# Altium project Avionics_Board.PrjPcb
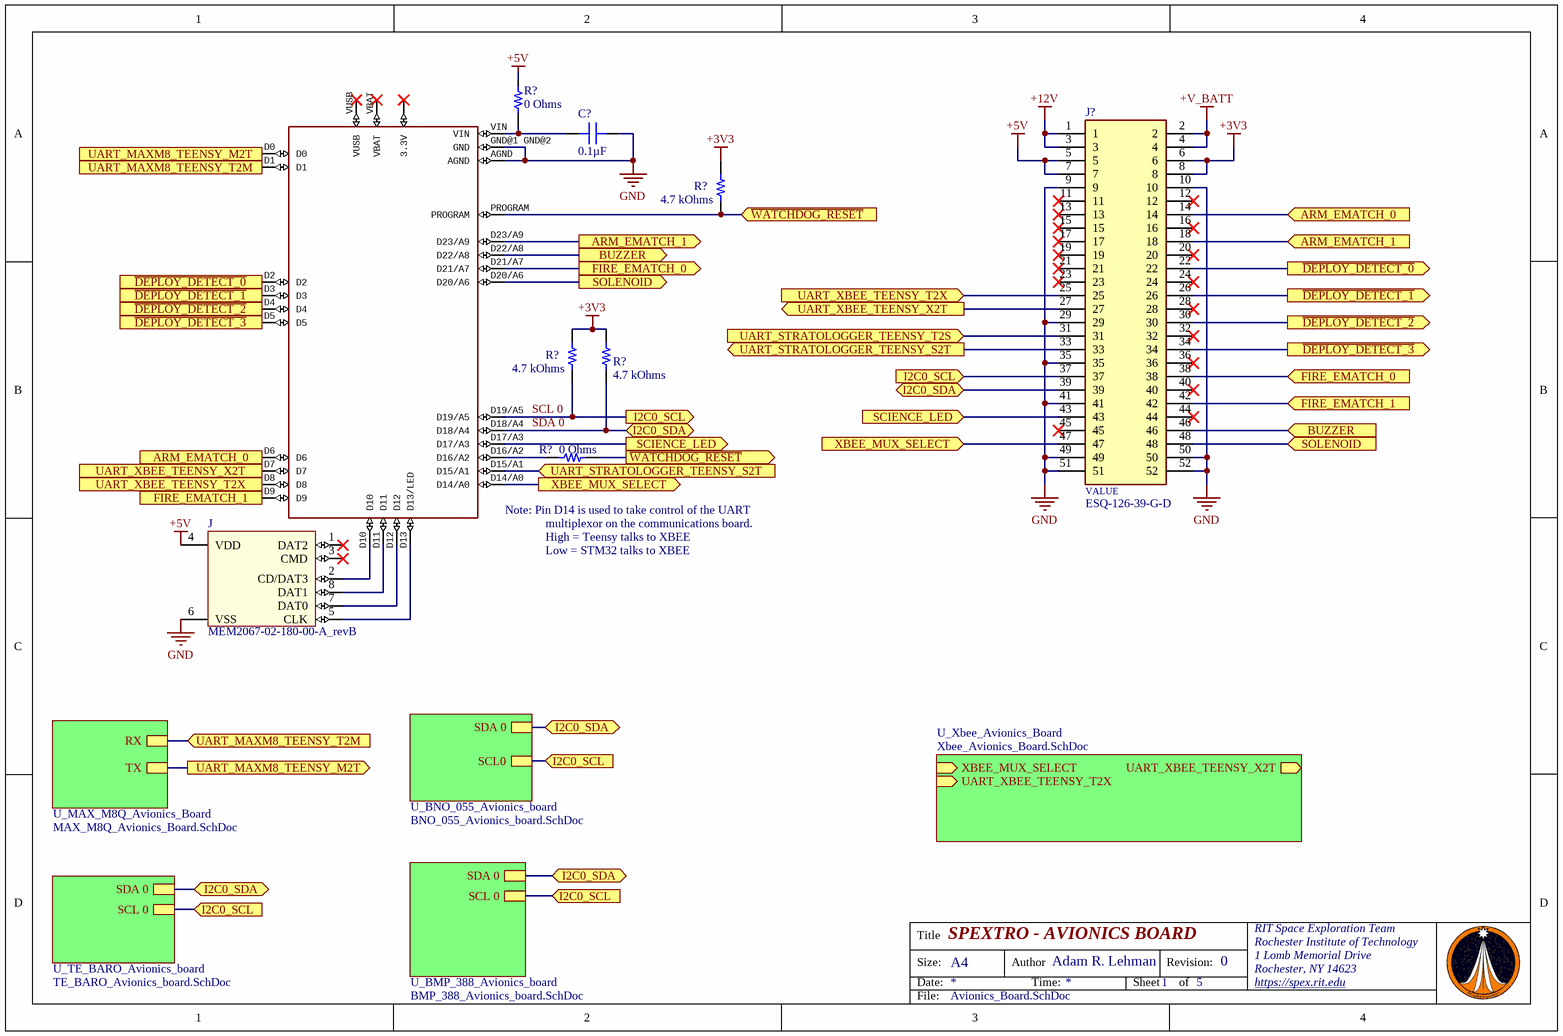
[diagram p0: Avionics_Board.SchDoc]
5 sheets, 39 parts. Net scope: hierarchical (ports join the sheet entries above them; power ports are global).
Sheets:
  Avionics_Board.SchDoc
    U_BMP_388_Avionics_board = BMP_388_Avionics_board.SchDoc
    U_BNO_055_Avionics_board = BNO_055_Avionics_board.SchDoc
    U_MAX_M8Q_Avionics_Board = MAX_M8Q_Avionics_Board.SchDoc
    U_TE_BARO_Avionics_board = TE_BARO_Avionics_board.SchDoc

## Sheet Avionics_Board.SchDoc: SPEXTRO - AVIONICS BOARD
size A4; Author: Adam R. Lehman; Revision: 0; SheetNumber: 1; SheetTotal: 5

### Parts
(Parts that share a designator on the sheet are numbered #1, #2 ... from top to bottom, then left to right.)
?  TEENSY4.0  [TEENSY4.0]  (value not drawn)
C?#1  0.1µF  [CAP 0603_1608]
J  MEM2067-02-180-00-A_revB  [MEM2067-02-180-00-A_revB]
J?#1  ESQ-126-39-G-D  [SAMTEC_ESQ-126-39-G-D]
R?#1  0 Ohms  [RES 0603_1608]
R?#2  4.7 kOhms  [RES 0603_1608]
R?#3  4.7 kOhms  [RES 0603_1608]
R?#4  4.7 kOhms  [RES 0603_1608]
R?#5  0 Ohms  [RES 0603_1608]

### Sub-sheets
U_BMP_388_Avionics_board = BMP_388_Avionics_board.SchDoc: SDA 0, SCL 0
U_BNO_055_Avionics_board = BNO_055_Avionics_board.SchDoc: SDA 0, SCL0
U_MAX_M8Q_Avionics_Board = MAX_M8Q_Avionics_Board.SchDoc: RX, TX
U_TE_BARO_Avionics_board = TE_BARO_Avionics_board.SchDoc: SDA 0, SCL 0
U_Xbee_Avionics_Board = Xbee_Avionics_Board.SchDoc (file not in this document): XBEE_MUX_SELECT (in), UART_XBEE_TEENSY_X2T (out), UART_XBEE_TEENSY_T2X (in)

### Ports
ARM_EMATCH_0 (in), ARM_EMATCH_0 (out), ARM_EMATCH_1 (in), ARM_EMATCH_1 (out), BUZZER (in), BUZZER (out), FIRE_EMATCH_0 (in), FIRE_EMATCH_0 (out), FIRE_EMATCH_1 (in), FIRE_EMATCH_1 (out), I2C0_SCL (in), I2C0_SCL (out), I2C0_SDA (bidir), SCIENCE_LED (in), SCIENCE_LED (out), SOLENOID (in), SOLENOID (out), UART_MAXM8_TEENSY_M2T (in), UART_MAXM8_TEENSY_M2T (out), UART_MAXM8_TEENSY_T2M (in), UART_MAXM8_TEENSY_T2M (out), UART_STRATOLOGGER_TEENSY_S2T (in), UART_STRATOLOGGER_TEENSY_S2T (out), UART_STRATOLOGGER_TEENSY_T2S (in), UART_XBEE_TEENSY_T2X (in), UART_XBEE_TEENSY_T2X (out), UART_XBEE_TEENSY_X2T (in), UART_XBEE_TEENSY_X2T (out), XBEE_MUX_SELECT (in), XBEE_MUX_SELECT (out), ~{DEPLOY_DETECT_0} (in), ~{DEPLOY_DETECT_0} (out), ~{DEPLOY_DETECT_1} (in), ~{DEPLOY_DETECT_1} (out), ~{DEPLOY_DETECT_2} (in), ~{DEPLOY_DETECT_2} (out), ~{DEPLOY_DETECT_3} (in), ~{DEPLOY_DETECT_3} (out), ~{WATCHDOG_RESET} (in), ~{WATCHDOG_RESET} (out)

### Nets
+3V3: J?#1.6 J?#1.8 R?#2.1 R?#3.1 R?#4.1
+5V: J.4(VDD) J?#1.5 J?#1.7 R?#1.2
+12V: J?#1.1 J?#1.3
+V_BATT: J?#1.2 J?#1.4
GND: ?.AGND ?.GND@1_GND@2(GND) C?#1.1 J.6(VSS) J?#1.9 J?#1.10 J?#1.29 J?#1.35 J?#1.41 J?#1.49 J?#1.50 J?#1.51 J?#1.52
SCL 0: ?.D19/A5 J?#1.37 R?#3.2 ; port I2C0_SCL, sheet U_BMP_388_Avionics_board/SCL 0, sheet U_BNO_055_Avionics_board/SCL0, sheet U_TE_BARO_Avionics_board/SCL 0
SDA 0: ?.D18/A4 J?#1.39 R?#4.2 ; port I2C0_SDA, sheet U_BMP_388_Avionics_board/SDA 0, sheet U_BNO_055_Avionics_board/SDA 0, sheet U_TE_BARO_Avionics_board/SDA 0
Net?_D0: ?.D0 ; port UART_MAXM8_TEENSY_M2T, sheet U_MAX_M8Q_Avionics_Board/TX
Net?_D1: ?.D1 ; port UART_MAXM8_TEENSY_T2M, sheet U_MAX_M8Q_Avionics_Board/RX
Net?_D2: ?.D2 J?#1.22 ; port ~{DEPLOY_DETECT_0}
Net?_D3: ?.D3 J?#1.26 ; port ~{DEPLOY_DETECT_1}
Net?_D4: ?.D4 J?#1.30 ; port ~{DEPLOY_DETECT_2}
Net?_D5: ?.D5 J?#1.34 ; port ~{DEPLOY_DETECT_3}
Net?_D6: ?.D6 J?#1.14 ; port ARM_EMATCH_0
Net?_D7: ?.D7 J?#1.27 ; port UART_XBEE_TEENSY_X2T
Net?_D8: ?.D8 J?#1.25 ; port UART_XBEE_TEENSY_T2X
Net?_D9: ?.D9 J?#1.42 ; port FIRE_EMATCH_1
Net?_D10: ?.D10 J.2(CD/DAT3)
Net?_D11: ?.D11 J.8(DAT1)
Net?_D12: ?.D12 J.7(DAT0)
Net?_D13: ?.D13(D13/LED) J.5(CLK)
Net?_D14/A0: ?.D14/A0 J?#1.47 ; port XBEE_MUX_SELECT
Net?_D15/A1: ?.D15/A1 J?#1.33 ; port UART_STRATOLOGGER_TEENSY_S2T
Net?_D16/A2: ?.D16/A2 R?#5.2
Net?_D17/A3: ?.D17/A3 J?#1.43 ; port SCIENCE_LED
Net?_D20/A6: ?.D20/A6 J?#1.48 ; port SOLENOID
Net?_D21/A7: ?.D21/A7 J?#1.38 ; port FIRE_EMATCH_0
Net?_D22/A8: ?.D22/A8 J?#1.46 ; port BUZZER
Net?_D23/A9: ?.D23/A9 J?#1.18 ; port ARM_EMATCH_1
Net?_PROGRAM: ?.PROGRAM R?#2.2 R?#5.1 ; port ~{WATCHDOG_RESET}
Net?_VIN: ?.VIN C?#1.2 R?#1.1
NetJ?#1_31: J?#1.31 ; port UART_STRATOLOGGER_TEENSY_T2S

Not connected (* = marked no-connect by the designer): ? ?1(3.3V)* VBAT* VUSB*; J 1(DAT2)* 3(CMD)*; J?#1 11* 12* 13* 15* 16* 17* 19* 20* 21* 23* 24* 28* 32* 36* 40* 44* 45*

### Notes on the sheet
- (near ?) Note: Pin D14 is used to take control of the UART
- multiplexor on the communications board.
- High = Teensy talks to XBEE
- Low = STM32 talks to XBEE
- Title
- Size:
- Date:
- A4
- Author
- Time:
- Sheet
- Revision:
- of
- RIT Space Exploration Team
- Rochester Institute of Technology
- 1 Lomb Memorial Drive
- Rochester, NY 14623
- https://spex.rit.edu
- File:
- (in symbol ESQ-126-39-G-D) VALUE

### Library data of the parts
? = TEENSY4.0: GateName_1: G$1; SymbolName_1: TEENSY4.0; LibraryName: Teensy4.0; DeviceSetName: TEENSY4.0; Package: TEENSY4.0
C?#1 = 100X14W104MV4T: CAP CER 0.1UF 10V X7R 0603; Manufacturer: Johanson Dielectrics Inc.; Tolerance: ±20%; Part Number: 100X14W104MV4T; Value: 0.1µF; Applications: Bypass, Decoupling; Capacitance: 0.1µF; ComponentLink1Description: Datasheet; ComponentLink1URL: https://www.johansondielectrics.com/downloads/x2y-filter-and-decoupling-capacitors.pdf; ComponentLink2Description: DigiKey Link; ComponentLink2URL: http://digikey.com/product-detail/en/johanson-dielectrics-inc/100X14W104MV4T/709-1101-1-ND/1655915; Device Package: 0603 (1608 Metric); Features: Low ESL (X2Y); LastUpdated: 1/21/2020 12:02:09 AM; Lifecycle Status: Active; Minimum Order: 1; Mounting Type: Surface Mount, MLCC; Operating Temperature: -55°C ~ 125°C; Package / Case: 0603 (1608 Metric); Packaging: TapeAndReel; PartId: 2680; Part Status: Active; Price: 0.11; Series: X2Y®; Size / Dimension: 0.064" L x 0.035" W (1.63mm x 0.89mm); Supplier 1: DigiKey; Supplier Part Number 1: 709-1101-1-ND; Temperature Coefficient: X7R; Thickness (Max): 0.026" (0.66mm); Voltage - Rated: 10V
J = MEM2067-02-180-00-A_revB: Micro SD Memory Card ConnectorSMT, Hinged, 1.80mm Profile
J?#1 = ESQ-126-39-G-D: 52 Position Elevated Socket Connector Through Hole; MF: Samtec; Value: *; Digi-Key_Purchase_URL: https://www.digikey.com/product-detail/en/samtec-inc/ESQ-126-39-G-D/SAM10462-ND/3601055?utm_source=snapeda&utm_medium=aggregator&utm_campaign=symbol; Package: None; MP: ESQ-126-39-G-D; SnapEDA_Link: https://www.snapeda.com/parts/ESQ-126-39-G-D/Samtec%20Inc./view-part/490181/?ref=snap; Digi-Key_Part_Number: SAM10462-ND
R?#1 R?#5 = PA0603-R-070RL: METAL CURRENT SENSOR-LOW T.C.R C; Manufacturer: Yageo; Power (Watts): 0.1W, 1/10W; Temperature Coefficient: ±150ppm/°C; Tolerance: Jumper; Part Number: PA0603-R-070RL; Value: 0 Ohms; ComponentLink1Description: Datasheet; ComponentLink1URL: http://www.yageo.com/NewPortal/_en/search/productDocs.jsp?YageoPartNumber=PA0603-R-070RL; ComponentLink2Description: DigiKey Link; ComponentLink2URL: http://digikey.com/product-detail/en/yageo/PA0603-R-070RL/YAG5757CT-ND/8256002; Composition: Metal Element; Device Package: 0603 (1608 Metric); Features: Current Sense, Moisture Resistant; Height - Seated (Max): 0.024" (0.60mm); LastUpdated: 1/21/2020 12:24:55 AM; Lifecycle Status: Active; Minimum Order: 1; Number of Terminations: 2; Operating Temperature: -55°C ~ 155°C; Package / Case: 0603 (1608 Metric); Packaging: TapeAndReel; PartId: 4862; Part Status: Active; Price: 0.09; Resistance: 0 Ohms; Series: PA; Size / Dimension: 0.063" L x 0.031" W (1.60mm x 0.80mm); Supplier 1: DigiKey; Supplier Part Number 1: YAG5757CT-ND; Supplier Device Package: 0603
R?#2-R?#4 = ERA-3AEB472V: RES SMD 4.7K OHM 0.1% 1/10W 0603; Manufacturer: Panasonic Electronic Components; Power (Watts): 0.1W, 1/10W; Temperature Coefficient: ±25ppm/°C; Part Number: ERA-3AEB472V; Value: 4.7 kOhms; ComponentLink1Description: Datasheet; ComponentLink1URL: https://industrial.panasonic.com/cdbs/www-data/pdf/RDM0000/AOA0000C307.pdf; ComponentLink2Description: DigiKey Link; ComponentLink2URL: http://digikey.com/product-detail/en/panasonic-electronic-components/ERA-3AEB472V/P4.7KDBCT-ND/1466068; Composition: Thin Film; Device Package: 0603 (1608 Metric); Features: Automotive AEC-Q200; Height - Seated (Max): 0.022" (0.55mm); LastUpdated: 1/21/2020 12:24:44 AM; Lifecycle Status: Active; Minimum Order: 1; Number of Terminations: 2; Operating Temperature: -55°C ~ 155°C; Package / Case: 0603 (1608 Metric); Packaging: TapeAndReel; PartId: 5519; Part Status: Active; Price: 0.04; Ratings: AEC-Q200; Resistance: 4.7 kOhms; Series: ERA-3A; Size / Dimension: 0.063" L x 0.031" W (1.60mm x 0.80mm); Supplier 1: DigiKey; Supplier Part Number 1: P4.7KDBCT-ND; Supplier Device Package: 0603; Tolerance: ±0.1%

## Sheet BMP_388_Avionics_board.SchDoc: BMP 388 Avionics Board
size A4; Author: Adam R. Lehman; SheetNumber: 3; SheetTotal: 5
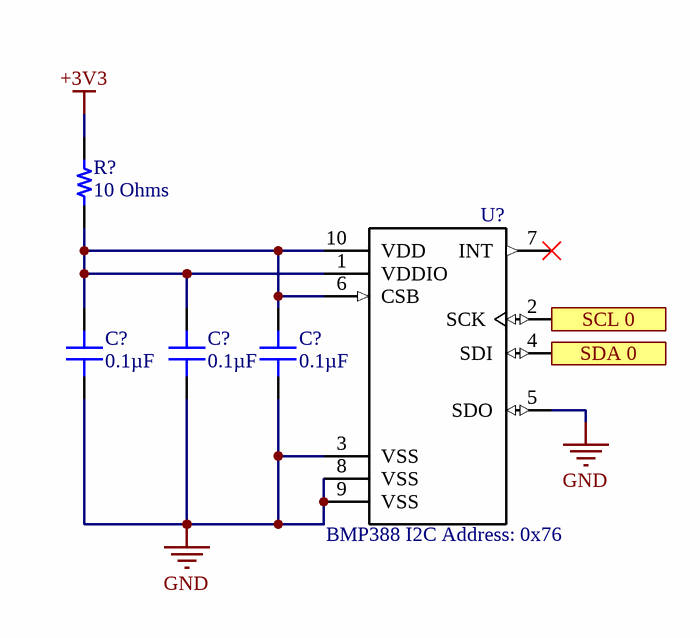
[diagram p1: BMP_388_Avionics_board.SchDoc]

### Parts
(Parts that share a designator on the sheet are numbered #1, #2 ... from top to bottom, then left to right.)
C?#2  0.1µF  [CAP 0603_1608]
C?#3  0.1µF  [CAP 0603_1608]
C?#4  0.1µF  [CAP 0603_1608]
R?#6  10 Ohms  [RES 0603_1608]
U?#1  BMP388 I2C Address: 0x76  [*PQFN50P200X200X80-10N]

### Ports
SCL 0, SDA 0

### Nets
+3V3: R?#6.2
GND: C?#2.1 C?#3.1 C?#4.1 U?#1.3(VSS) U?#1.5(SDO) U?#1.8(VSS) U?#1.9(VSS)
SCL 0: U?#1.2(SCK) ; port SCL 0
SDA 0: U?#1.4(SDI) ; port SDA 0
NetC?#2_2: C?#2.2 C?#3.2 C?#4.2 R?#6.1 U?#1.1(VDDIO) U?#1.6(CSB) U?#1.10(VDD)

Not connected (* = marked no-connect by the designer): U?#1 7(INT)*

### Notes on the sheet
- Title
- Size:
- Date:
- A4
- Author
- Time:
- Sheet
- Revision:
- of
- RIT Space Exploration Team
- Rochester Institute of Technology
- 1 Lomb Memorial Drive
- Rochester, NY 14623
- https://spex.rit.edu
- File:

### Library data of the parts
C?#2-C?#4 = 100X14W104MV4T: as C?#1 on sheet Avionics_Board; Part Number: 100X14W104MV4T; Value: 0.1µF; Applications: Bypass, Decoupling; Capacitance: 0.1µF; ComponentLink1Description: Datasheet; ComponentLink1URL: https://www.johansondielectrics.com/downloads/x2y-filter-and-decoupling-capacitors.pdf; ComponentLink2Description: DigiKey Link; ComponentLink2URL: http://digikey.com/product-detail/en/johanson-dielectrics-inc/100X14W104MV4T/709-1101-1-ND/1655915; Device Package: 0603 (1608 Metric); Features: Low ESL (X2Y); LastUpdated: 1/21/2020 12:02:09 AM; Lifecycle Status: Active; Minimum Order: 1; Mounting Type: Surface Mount, MLCC; Operating Temperature: -55°C ~ 125°C; Package / Case: 0603 (1608 Metric); Packaging: TapeAndReel; PartId: 2680; Part Status: Active; Price: 0.11; Series: X2Y®; Size / Dimension: 0.064" L x 0.035" W (1.63mm x 0.89mm); Supplier 1: DigiKey; Supplier Part Number 1: 709-1101-1-ND; Temperature Coefficient: X7R; Thickness (Max): 0.026" (0.66mm); Voltage - Rated: 10V
R?#6 = SG731JTTD100K: SMD RESISTOR; Manufacturer: KOA Speer Electronics, Inc.; Power (Watts): 0.1W, 1/10W; Temperature Coefficient: ±200ppm/°C; Tolerance: ±10%; Part Number: SG731JTTD100K; Value: 10 Ohms; ComponentLink1Description: Datasheet; ComponentLink1URL: http://www.koaspeer.com/catimages/Products/SG73/SG73.pdf; ComponentLink2Description: DigiKey Link; ComponentLink2URL: http://digikey.com/product-detail/en/koa-speer-electronics-inc/SG731JTTD100K/2019-SG731JTTD100KCT-ND/10187255; Composition: Thick Film; Device Package: 0603 (1608 Metric); Features: Automotive AEC-Q200, Moisture Resistant, Pulse Withstanding; Height - Seated (Max): 0.022" (0.55mm); LastUpdated: 1/21/2020 12:19:43 AM; Lifecycle Status: Active; Minimum Order: 1; Number of Terminations: 2; Operating Temperature: -55°C ~ 155°C; Package / Case: 0603 (1608 Metric); Packaging: TapeAndReel; PartId: 17783; Part Status: Active; Price: 0.02; Ratings: AEC-Q200; Resistance: 10 Ohms; Series: SG73; Size / Dimension: 0.063" L x 0.031" W (1.60mm x 0.80mm); Supplier 1: DigiKey; Supplier Part Number 1: 2019-SG731JTTD100KCT-ND; Supplier Device Package: 0603
U?#1 = BMP388: Pressure Sensor 4.35PSI ~ 18.13PSI _30kPa ~ 125kPa_ Absolute 10-WFLGA; MF: Bosch Sensortec; Digi-Key_Part_Number: 828-1079-1-ND; SnapEDA_Link: https://www.snapeda.com/parts/BMP388/Bosch%20Sensortec/view-part/2747857/?ref=snap; Package: WFLGA-10 Bosch Tools; Digi-Key_Purchase_URL: https://www.digikey.com/product-detail/en/bosch-sensortec/BMP388/828-1079-1-ND/8322640?utm_source=snapeda&utm_medium=aggregator&utm_campaign=symbol; MP: BMP388; Value: *

## Sheet BNO_055_Avionics_board.SchDoc: BNO 055 - Avionics Board
size A4; Author: Adam R. Lehman; SheetNumber: 2; SheetTotal: 5
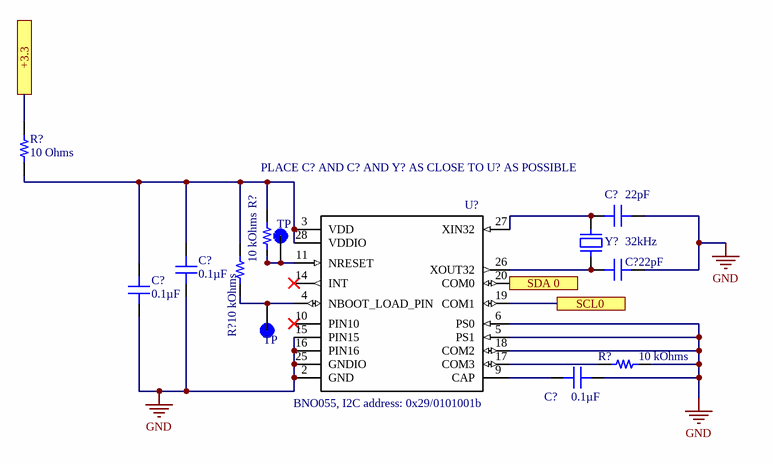
[diagram p2: BNO_055_Avionics_board.SchDoc]

### Parts
(Parts that share a designator on the sheet are numbered #1, #2 ... from top to bottom, then left to right.)
C?#5  22pF  [CAP 0603_1608]
C?#6  0.1µF  [CAP 0603_1608]
C?#7  22pF  [CAP 0603_1608]
C?#8  0.1µF  [CAP 0603_1608]
C?#9  0.1µF  [CAP 0603_1608]
R?#7  10 Ohms  [RES 0603_1608]
R?#8  10 kOhms  [RES 0603_1608]
R?#9  10 kOhms  [RES 0603_1608]
R?#10  10 kOhms  [RES 0603_1608]
TP#1  (no value)  [HARWIN_S2751-46R]
TP#2  (no value)  [HARWIN_S2751-46R]
U?#2  BNO055, I2C address: 0x29/0101001b  [*LGA28R50P4X10_380X520X100]
Y?  32kHz  [ABRACON ABS25]

### Ports
+3.3, SCL0, SDA 0

### Nets
GND: C?#5.2 C?#6.1 C?#7.1 C?#8.1 C?#9.1 R?#10.1 U?#2.2(GND) U?#2.5(PS1) U?#2.6(PS0) U?#2.15(PIN15) U?#2.16(PIN16) U?#2.18(COM2) U?#2.25(GNDIO)
SCL 0: U?#2.19(COM1) ; port SCL0
SDA 0: U?#2.20(COM0) ; port SDA 0
NetC?#5_1: C?#5.1 U?#2.27(XIN32) Y?.1
NetC?#6_2: C?#6.2 C?#8.2 R?#7.1 R?#8.1 R?#9.1 U?#2.3(VDD) U?#2.28(VDDIO)
NetC?#7_2: C?#7.2 U?#2.26(XOUT32) Y?.4
NetC?#9_2: C?#9.2 U?#2.9(CAP)
NetR?#7_2: R?#7.2 ; port +3.3
NetR?#8_2: R?#8.2 TP#1.1(TP) U?#2.11(NRESET)
NetR?#9_2: R?#9.2 TP#2.1(TP) U?#2.4(NBOOT_LOAD_PIN)
NetR?#10_2: R?#10.2 U?#2.17(COM3)

Not connected (* = marked no-connect by the designer): U?#2 10(PIN10)* 14(INT)*

### Notes on the sheet
- PLACE C? AND C? AND Y? AS CLOSE TO U? AS POSSIBLE
- Title
- Size:
- Date:
- A4
- Author
- Time:
- Sheet
- Revision:
- of
- RIT Space Exploration Team
- Rochester Institute of Technology
- 1 Lomb Memorial Drive
- Rochester, NY 14623
- https://spex.rit.edu
- File:

### Library data of the parts
C?#5 C?#7 = C0603C220J5GACTU: CAP CER 22PF 50V C0G/NP0 0603; Manufacturer: KEMET; Temperature Coefficient: C0G, NP0; Tolerance: ±5%; Part Number: C0603C220J5GACTU; Value: 22pF; Applications: General Purpose; Capacitance: 22pF; ComponentLink1Description: Datasheet; ComponentLink1URL: https://api.kemet.com/component-edge/download/datasheet/C0603C220J5GACTU.pdf; ComponentLink2Description: DigiKey Link; ComponentLink2URL: http://digikey.com/product-detail/en/kemet/C0603C220J5GACTU/399-1053-1-ND/411328; Device Package: 0603 (1608 Metric); Features: Low ESL; LastUpdated: 1/21/2020 12:02:09 AM; Lifecycle Status: Active; Minimum Order: 1; Mounting Type: Surface Mount, MLCC; Operating Temperature: -55°C ~ 125°C; Package / Case: 0603 (1608 Metric); Packaging: TapeAndReel; PartId: 2302; Part Status: Active; Price: 0.02; Series: SMD Comm C0G; Size / Dimension: 0.063" L x 0.031" W (1.60mm x 0.80mm); Supplier 1: DigiKey; Supplier Part Number 1: 399-1053-1-ND; Thickness (Max): 0.034" (0.87mm); Voltage - Rated: 50V
C?#6 C?#8 C?#9 = 100X14W104MV4T: as C?#1 on sheet Avionics_Board; Part Number: 100X14W104MV4T; Value: 0.1µF; Applications: Bypass, Decoupling; Capacitance: 0.1µF; ComponentLink1Description: Datasheet; ComponentLink1URL: https://www.johansondielectrics.com/downloads/x2y-filter-and-decoupling-capacitors.pdf; ComponentLink2Description: DigiKey Link; ComponentLink2URL: http://digikey.com/product-detail/en/johanson-dielectrics-inc/100X14W104MV4T/709-1101-1-ND/1655915; Device Package: 0603 (1608 Metric); Features: Low ESL (X2Y); LastUpdated: 1/21/2020 12:02:09 AM; Lifecycle Status: Active; Minimum Order: 1; Mounting Type: Surface Mount, MLCC; Operating Temperature: -55°C ~ 125°C; Package / Case: 0603 (1608 Metric); Packaging: TapeAndReel; PartId: 2680; Part Status: Active; Price: 0.11; Series: X2Y®; Size / Dimension: 0.064" L x 0.035" W (1.63mm x 0.89mm); Supplier 1: DigiKey; Supplier Part Number 1: 709-1101-1-ND; Temperature Coefficient: X7R; Thickness (Max): 0.026" (0.66mm); Voltage - Rated: 10V
R?#7 = SG731JTTD100K: as R?#6 on sheet BMP_388_Avionics_board; Part Number: SG731JTTD100K; Value: 10 Ohms; ComponentLink1Description: Datasheet; ComponentLink1URL: http://www.koaspeer.com/catimages/Products/SG73/SG73.pdf; ComponentLink2Description: DigiKey Link; ComponentLink2URL: http://digikey.com/product-detail/en/koa-speer-electronics-inc/SG731JTTD100K/2019-SG731JTTD100KCT-ND/10187255; Composition: Thick Film; Device Package: 0603 (1608 Metric); Features: Automotive AEC-Q200, Moisture Resistant, Pulse Withstanding; Height - Seated (Max): 0.022" (0.55mm); LastUpdated: 1/21/2020 12:19:43 AM; Lifecycle Status: Active; Minimum Order: 1; Number of Terminations: 2; Operating Temperature: -55°C ~ 155°C; Package / Case: 0603 (1608 Metric); Packaging: TapeAndReel; PartId: 17783; Part Status: Active; Price: 0.02; Ratings: AEC-Q200; Resistance: 10 Ohms; Series: SG73; Size / Dimension: 0.063" L x 0.031" W (1.60mm x 0.80mm); Supplier 1: DigiKey; Supplier Part Number 1: 2019-SG731JTTD100KCT-ND; Supplier Device Package: 0603
R?#8-R?#10 = RNCS0603BKE10K0: RES 10K OHM 0.1% 1/16W 0603; Manufacturer: Stackpole Electronics Inc; Power (Watts): 0.063W, 1/16W; Temperature Coefficient: ±25ppm/°C; Part Number: RNCS0603BKE10K0; Value: 10 kOhms; ComponentLink1Description: Datasheet; ComponentLink1URL: https://www.seielect.com/catalog/sei-rncs_rnch.pdf; ComponentLink2Description: DigiKey Link; ComponentLink2URL: http://digikey.com/product-detail/en/stackpole-electronics-inc/RNCS0603BKE10K0/RNCS0603BKE10K0CT-ND/1800113; Composition: Thin Film; Device Package: 0603 (1608 Metric); Features: Anti-Corrosive, Automotive AEC-Q200, Moisture Resistant; Height - Seated (Max): 0.022" (0.55mm); LastUpdated: 1/21/2020 12:25:01 AM; Lifecycle Status: Active; Minimum Order: 1; Number of Terminations: 2; Operating Temperature: -55°C ~ 155°C; Package / Case: 0603 (1608 Metric); Packaging: TapeAndReel; PartId: 4838; Part Status: Active; Price: 0.08; Ratings: AEC-Q200; Resistance: 10 kOhms; Series: RNCS; Size / Dimension: 0.061" L x 0.031" W (1.55mm x 0.80mm); Supplier 1: DigiKey; Supplier Part Number 1: RNCS0603BKE10K0CT-ND; Supplier Device Package: 0603; Tolerance: ±0.1%
TP#1 TP#2 = S2751-46R: Natural PC Test Point Brass, Tin Plating Surface Mount Mounting Type; MF: Harwin Inc.; Package: DIP-64 Harwin; SnapEDA_Link: https://www.snapeda.com/parts/S2751-46R/Harwin%20Inc./view-part/602614/?ref=snap; MP: S2751-46R; Value: *
U?#2 = BNO055: / Accelerometer, Gyroscope, Magnetometer, 9 Axis Sensor IÂ²C, UART Output /; MF: Bosch; Package: LGA-28 Bosch; Digi-Key_Part_Number: 828-1058-1-ND; Digi-Key_Purchase_URL: https://www.digikey.com/product-detail/en/bosch-sensortec/BNO055/828-1058-1-ND/6136309?utm_source=snapeda&utm_medium=aggregator&utm_campaign=symbol; MP: BNO055; SnapEDA_Link: https://www.snapeda.com/parts/BNO055/Bosch%20Sensortec/view-part/51961/?ref=snap; Value: *
Y? = ABS25-32.000KHZ-T: CRYSTAL 32.0000KHZ 12.5PF SMD; Manufacturer: Abracon LLC; ESR (Equivalent Series Resistance): 50 kOhms; Frequency Tolerance: ±30ppm; Operating Mode: Fundamental; Part Number: ABS25-32.000KHZ-T; ComponentLink1Description: Datasheet; ComponentLink1URL: https://abracon.com/Resonators/abs25.pdf; ComponentLink2Description: DigiKey Link; ComponentLink2URL: http://digikey.com/product-detail/en/abracon-llc/ABS25-32.000KHZ-T/535-10242-1-ND/2218055; Device Package: 4-SOJ, 5.50mm pitch; Frequency: 32kHz; Height - Seated (Max): 0.098" (2.50mm); LastUpdated: 1/21/2020 3:21:21 AM; Lifecycle Status: Active; Load Capacitance: 12.5pF; Minimum Order: 1; Mounting Type: Surface Mount; Operating Temperature: -40°C ~ 85°C; Package / Case: 4-SOJ, 5.50mm pitch; Packaging: TapeAndReel; PartId: 398; Part Status: Active; Price: 0.71; Series: ABS25; Size / Dimension: 0.315" L x 0.150" W (8.00mm x 3.80mm); Supplier 1: DigiKey; Supplier Part Number 1: 535-10242-1-ND; Type: kHz Crystal (Tuning Fork); Value: 32kHz

## Sheet MAX_M8Q_Avionics_Board.SchDoc: MAX_M8Q Avionics Board
size A4; Author: Adam R. Lehman; SheetNumber: 5; SheetTotal: 5
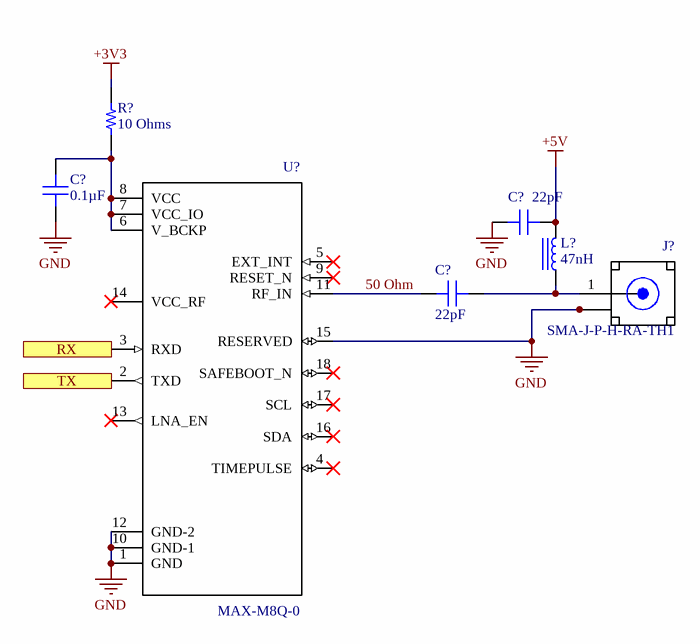
[diagram p3: MAX_M8Q_Avionics_Board.SchDoc]

### Parts
(Parts that share a designator on the sheet are numbered #1, #2 ... from top to bottom, then left to right.)
C?#10  0.1µF  [CAP 0603_1608]
C?#11  22pF  [CAP 0603_1608]
C?#12  22pF  [CAP 0603_1608]
J?#2  SMA-J-P-H-RA-TH1  [*SAMTEC_SMA-J-P-H-RA-TH1]
L?  47nH  [IND 0402_1005 RF WW]
R?#11  10 Ohms  [RES 0603_1608]
U?#3  MAX-M8Q-0  [*XCVR_MAX-M8C-0-10]

### Ports
RX, TX

### Nets
+3V3: R?#11.2
+5V: C?#11.2 L?.2
GND: C?#10.1 C?#11.1 J?#2.2(GND) J?#2.3(GND) J?#2.4(GND) J?#2.5(GND) U?#3.1(GND) U?#3.10(GND-1) U?#3.12(GND-2) U?#3.15(RESERVED)
50 Ohm: C?#12.2 U?#3.11(RF_IN)
Net?_D0: U?#3.2(TXD) ; port TX
Net?_D1: U?#3.3(RXD) ; port RX
NetC?#10_2: C?#10.2 R?#11.1 U?#3.6(V_BCKP) U?#3.7(VCC_IO) U?#3.8(VCC)
NetC?#12_1: C?#12.1 J?#2.1(SIGNAL) L?.1

Not connected (* = marked no-connect by the designer): U?#3 4(TIMEPULSE)* 5(EXT_INT)* 9(RESET_N)* 13(LNA_EN)* 14(VCC_RF)* 16(SDA)* 17(SCL)* 18(SAFEBOOT_N)*

### Notes on the sheet
- Title
- Size:
- Date:
- A4
- Author
- Time:
- Sheet
- Revision:
- of
- RIT Space Exploration Team
- Rochester Institute of Technology
- 1 Lomb Memorial Drive
- Rochester, NY 14623
- https://spex.rit.edu
- File:

### Library data of the parts
C?#10 = 100X14W104MV4T: as C?#1 on sheet Avionics_Board; Part Number: 100X14W104MV4T; Value: 0.1µF; Applications: Bypass, Decoupling; Capacitance: 0.1µF; ComponentLink1Description: Datasheet; ComponentLink1URL: https://www.johansondielectrics.com/downloads/x2y-filter-and-decoupling-capacitors.pdf; ComponentLink2Description: DigiKey Link; ComponentLink2URL: http://digikey.com/product-detail/en/johanson-dielectrics-inc/100X14W104MV4T/709-1101-1-ND/1655915; Device Package: 0603 (1608 Metric); Features: Low ESL (X2Y); LastUpdated: 1/21/2020 12:02:09 AM; Lifecycle Status: Active; Minimum Order: 1; Mounting Type: Surface Mount, MLCC; Operating Temperature: -55°C ~ 125°C; Package / Case: 0603 (1608 Metric); Packaging: TapeAndReel; PartId: 2680; Part Status: Active; Price: 0.11; Series: X2Y®; Size / Dimension: 0.064" L x 0.035" W (1.63mm x 0.89mm); Supplier 1: DigiKey; Supplier Part Number 1: 709-1101-1-ND; Temperature Coefficient: X7R; Thickness (Max): 0.026" (0.66mm); Voltage - Rated: 10V
C?#11 C?#12 = C0603C220J5GACTU: as C?#5 on sheet BNO_055_Avionics_board; Part Number: C0603C220J5GACTU; Value: 22pF; Applications: General Purpose; Capacitance: 22pF; ComponentLink1Description: Datasheet; ComponentLink1URL: https://api.kemet.com/component-edge/download/datasheet/C0603C220J5GACTU.pdf; ComponentLink2Description: DigiKey Link; ComponentLink2URL: http://digikey.com/product-detail/en/kemet/C0603C220J5GACTU/399-1053-1-ND/411328; Device Package: 0603 (1608 Metric); Features: Low ESL; LastUpdated: 1/21/2020 12:02:09 AM; Lifecycle Status: Active; Minimum Order: 1; Mounting Type: Surface Mount, MLCC; Operating Temperature: -55°C ~ 125°C; Package / Case: 0603 (1608 Metric); Packaging: TapeAndReel; PartId: 2302; Part Status: Active; Price: 0.02; Series: SMD Comm C0G; Size / Dimension: 0.063" L x 0.031" W (1.60mm x 0.80mm); Supplier 1: DigiKey; Supplier Part Number 1: 399-1053-1-ND; Thickness (Max): 0.034" (0.87mm); Voltage - Rated: 50V
L? = LQW15AN47NG00D: FIXED IND 47NH 210MA 1.08 OHM; Manufacturer: Murata Electronics; DC Resistance (DCR): 1.08Ohm Max; Frequency - Self Resonant: 2.9GHz; Inductance Frequency - Test: 100MHz; Material - Core: Non-Magnetic; Q @ Freq: 25 @ 200MHz; Shielding: Unshielded; Tolerance: ±2%; Type: Wirewound; Part Number: LQW15AN47NG00D; ComponentLink1Description: Datasheet; ComponentLink1URL: https://search.murata.co.jp/Ceramy/image/img/P02/JELF243A-0050.pdf; ComponentLink2Description: DigiKey Link; ComponentLink2URL: http://digikey.com/product-detail/en/murata-electronics/LQW15AN47NG00D/490-6819-1-ND/3846016; Current Rating (Amps): 210mA; Device Package: 0402 (1005 Metric); Height - Seated (Max): 0.024" (0.60mm); Inductance: 47nH; LastUpdated: 1/21/2020 3:29:00 AM; Lifecycle Status: Active; Minimum Order: 1; Mounting Type: Surface Mount; Operating Temperature: -55°C ~ 125°C; Package / Case: 0402 (1005 Metric); Packaging: TapeAndReel; PartId: 306; Part Status: Active; Price: 0.05; Series: LQW15; Size / Dimension: 0.039" L x 0.020" W (1.00mm x 0.50mm); Supplier 1: DigiKey; Supplier Part Number 1: 490-6819-1-ND; Value: 47nH
R?#11 = SG731JTTD100K: as R?#6 on sheet BMP_388_Avionics_board; Part Number: SG731JTTD100K; Value: 10 Ohms; ComponentLink1Description: Datasheet; ComponentLink1URL: http://www.koaspeer.com/catimages/Products/SG73/SG73.pdf; ComponentLink2Description: DigiKey Link; ComponentLink2URL: http://digikey.com/product-detail/en/koa-speer-electronics-inc/SG731JTTD100K/2019-SG731JTTD100KCT-ND/10187255; Composition: Thick Film; Device Package: 0603 (1608 Metric); Features: Automotive AEC-Q200, Moisture Resistant, Pulse Withstanding; Height - Seated (Max): 0.022" (0.55mm); LastUpdated: 1/21/2020 12:19:43 AM; Lifecycle Status: Active; Minimum Order: 1; Number of Terminations: 2; Operating Temperature: -55°C ~ 155°C; Package / Case: 0603 (1608 Metric); Packaging: TapeAndReel; PartId: 17783; Part Status: Active; Price: 0.02; Ratings: AEC-Q200; Resistance: 10 Ohms; Series: SG73; Size / Dimension: 0.063" L x 0.031" W (1.60mm x 0.80mm); Supplier 1: DigiKey; Supplier Part Number 1: 2019-SG731JTTD100KCT-ND; Supplier Device Package: 0603
J?#2 = SMA-J-P-H-RA-TH1: SnapEDA_Link: https://www.snapeda.com/parts/SMA-J-P-H-RA-TH1/Samtec%20Inc./view-part/134498/?ref=snap; Value: *
U?#3 = MAX-M8Q-0: Value: *

## Sheet TE_BARO_Avionics_board.SchDoc: TE MS5611-01BA03 Avionics Board
size A4; Author: Adam R. Lehman; SheetNumber: 4; SheetTotal: 5
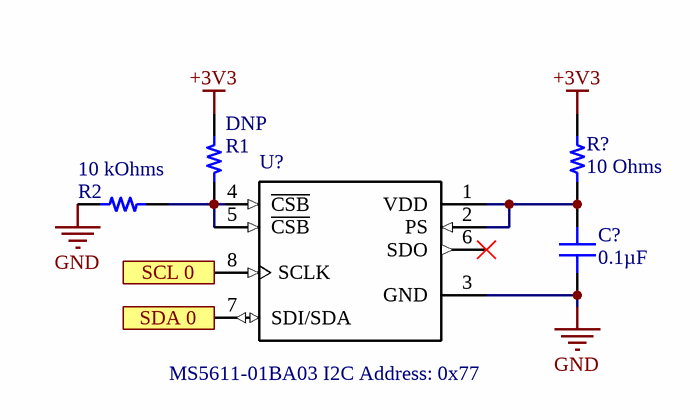
[diagram p4: TE_BARO_Avionics_board.SchDoc]

### Parts
(Parts that share a designator on the sheet are numbered #1, #2 ... from top to bottom, then left to right.)
C?#13  0.1µF  [CAP 0603_1608]
R1  DNP  [RES 0603_1608]  (no BOM)
R2  10 kOhms  [RES 0603_1608]
R?#12  10 Ohms  [RES 0603_1608]
U?#4  MS561101BA03-50  [*SON125P500X300X100-8N]  (value not drawn)

### Ports
SCL 0, SDA 0

### Nets
+3V3: R1.1 R?#12.2
GND: C?#13.1 R2.2 U?#4.3(GND)
SCL 0: U?#4.8(SCLK) ; port SCL 0
SDA 0: U?#4.7(SDI/SDA) ; port SDA 0
NetC?#13_2: C?#13.2 R?#12.1 U?#4.1(VDD) U?#4.2(PS)
NetR1_2: R1.2 R2.1 U?#4.4(~{CSB}) U?#4.5(~{CSB})

Not connected (* = marked no-connect by the designer): U?#4 6(SDO)*

### Notes on the sheet
- (near U?#4) MS5611-01BA03 I2C Address: 0x77
- Title
- Size:
- Date:
- A4
- Author
- Time:
- Sheet
- Revision:
- of
- RIT Space Exploration Team
- Rochester Institute of Technology
- 1 Lomb Memorial Drive
- Rochester, NY 14623
- https://spex.rit.edu
- File:

### Library data of the parts
C?#13 = 100X14W104MV4T: as C?#1 on sheet Avionics_Board; Part Number: 100X14W104MV4T; Value: 0.1µF; Applications: Bypass, Decoupling; Capacitance: 0.1µF; ComponentLink1Description: Datasheet; ComponentLink1URL: https://www.johansondielectrics.com/downloads/x2y-filter-and-decoupling-capacitors.pdf; ComponentLink2Description: DigiKey Link; ComponentLink2URL: http://digikey.com/product-detail/en/johanson-dielectrics-inc/100X14W104MV4T/709-1101-1-ND/1655915; Device Package: 0603 (1608 Metric); Features: Low ESL (X2Y); LastUpdated: 1/21/2020 12:02:09 AM; Lifecycle Status: Active; Minimum Order: 1; Mounting Type: Surface Mount, MLCC; Operating Temperature: -55°C ~ 125°C; Package / Case: 0603 (1608 Metric); Packaging: TapeAndReel; PartId: 2680; Part Status: Active; Price: 0.11; Series: X2Y®; Size / Dimension: 0.064" L x 0.035" W (1.63mm x 0.89mm); Supplier 1: DigiKey; Supplier Part Number 1: 709-1101-1-ND; Temperature Coefficient: X7R; Thickness (Max): 0.026" (0.66mm); Voltage - Rated: 10V
R1 = RNCS0603BKE10K0: RES 10K OHM 0.1% 1/16W 0603; Manufacturer: Stackpole Electronics Inc; Power (Watts): 0.063W, 1/16W; Resistance: 10 kOhms; Temperature Coefficient: ±25ppm/°C; Part Number: RNCS0603BKE10K0; Value: DNP; ComponentLink1Description: Datasheet; ComponentLink1URL: https://www.seielect.com/catalog/sei-rncs_rnch.pdf; ComponentLink2Description: DigiKey Link; ComponentLink2URL: http://digikey.com/product-detail/en/stackpole-electronics-inc/RNCS0603BKE10K0/RNCS0603BKE10K0CT-ND/1800113; Composition: Thin Film; Device Package: 0603 (1608 Metric); Features: Anti-Corrosive, Automotive AEC-Q200, Moisture Resistant; Height - Seated (Max): 0.022" (0.55mm); LastUpdated: 1/21/2020 12:25:01 AM; Lifecycle Status: Active; Minimum Order: 1; Number of Terminations: 2; Operating Temperature: -55°C ~ 155°C; Package / Case: 0603 (1608 Metric); Packaging: TapeAndReel; PartId: 4838; Part Status: Active; Price: 0.08; Ratings: AEC-Q200; Series: RNCS; Size / Dimension: 0.061" L x 0.031" W (1.55mm x 0.80mm); Supplier 1: DigiKey; Supplier Part Number 1: RNCS0603BKE10K0CT-ND; Supplier Device Package: 0603; Tolerance: ±0.1%
R2 = RNCS0603BKE10K0: as R?#8 on sheet BNO_055_Avionics_board; Part Number: RNCS0603BKE10K0; Value: 10 kOhms; ComponentLink1Description: Datasheet; ComponentLink1URL: https://www.seielect.com/catalog/sei-rncs_rnch.pdf; ComponentLink2Description: DigiKey Link; ComponentLink2URL: http://digikey.com/product-detail/en/stackpole-electronics-inc/RNCS0603BKE10K0/RNCS0603BKE10K0CT-ND/1800113; Composition: Thin Film; Device Package: 0603 (1608 Metric); Features: Anti-Corrosive, Automotive AEC-Q200, Moisture Resistant; Height - Seated (Max): 0.022" (0.55mm); LastUpdated: 1/21/2020 12:25:01 AM; Lifecycle Status: Active; Minimum Order: 1; Number of Terminations: 2; Operating Temperature: -55°C ~ 155°C; Package / Case: 0603 (1608 Metric); Packaging: TapeAndReel; PartId: 4838; Part Status: Active; Price: 0.08; Ratings: AEC-Q200; Resistance: 10 kOhms; Series: RNCS; Size / Dimension: 0.061" L x 0.031" W (1.55mm x 0.80mm); Supplier 1: DigiKey; Supplier Part Number 1: RNCS0603BKE10K0CT-ND; Supplier Device Package: 0603; Tolerance: ±0.1%
R?#12 = SG731JTTD100K: as R?#6 on sheet BMP_388_Avionics_board; Part Number: SG731JTTD100K; Value: 10 Ohms; ComponentLink1Description: Datasheet; ComponentLink1URL: http://www.koaspeer.com/catimages/Products/SG73/SG73.pdf; ComponentLink2Description: DigiKey Link; ComponentLink2URL: http://digikey.com/product-detail/en/koa-speer-electronics-inc/SG731JTTD100K/2019-SG731JTTD100KCT-ND/10187255; Composition: Thick Film; Device Package: 0603 (1608 Metric); Features: Automotive AEC-Q200, Moisture Resistant, Pulse Withstanding; Height - Seated (Max): 0.022" (0.55mm); LastUpdated: 1/21/2020 12:19:43 AM; Lifecycle Status: Active; Minimum Order: 1; Number of Terminations: 2; Operating Temperature: -55°C ~ 155°C; Package / Case: 0603 (1608 Metric); Packaging: TapeAndReel; PartId: 17783; Part Status: Active; Price: 0.02; Ratings: AEC-Q200; Resistance: 10 Ohms; Series: SG73; Size / Dimension: 0.063" L x 0.031" W (1.60mm x 0.80mm); Supplier 1: DigiKey; Supplier Part Number 1: 2019-SG731JTTD100KCT-ND; Supplier Device Package: 0603
U?#4 = MS561101BA03-50: Pressure Sensor 1.44V to 3.6V 0.01bar to 1.2bar Absolute 8-Pin QFN T/R; MF: TE Connectivity; SnapEDA_Link: https://www.snapeda.com/parts/MS561101BA03-50/TE%20Connectivity%20ALCOSWITCH%20Switches/view-part/213247/?ref=snap; Digi-Key_Part_Number: 223-1622-1-ND; EU_RoHS_Compliance: Compliant; TE_purchase_URL: https://www.te.com/usa-en/product-MS561101BA03-50.html?te_bu=Cor&te_type=disp&te_campaign=seda_glo_cor-seda-global-disp-prtnr-fy19-seda-model-bom-cta_sma-317_1&elqCampaignId=32493; Package: SMD-8 TE Connectivity; MP: MS561101BA03-50; Digi-Key_Purchase_URL: https://www.digikey.com/product-detail/en/te-connectivity-measurement-specialties/MS561101BA03-50/223-1622-1-ND/5277638?utm_source=snapeda&utm_medium=aggregator&utm_campaign=symbol; Value: *

## Nets that join several sheets
+3V3: Avionics_Board (5 pins), BMP_388_Avionics_board (R?#6.2), MAX_M8Q_Avionics_Board (R?#11.2), TE_BARO_Avionics_board (R1.1 R?#12.2)
+5V: Avionics_Board (J.4 J?#1.5 J?#1.7 R?#1.2), MAX_M8Q_Avionics_Board (C?#11.2 L?.2)
GND: Avionics_Board (13 pins), BMP_388_Avionics_board (7 pins), BNO_055_Avionics_board (13 pins), MAX_M8Q_Avionics_Board (10 pins), TE_BARO_Avionics_board (C?#13.1 R2.2 U?#4.3)
Net?_D0: Avionics_Board (?.D0), MAX_M8Q_Avionics_Board (U?#3.2)
Net?_D1: Avionics_Board (?.D1), MAX_M8Q_Avionics_Board (U?#3.3)
SCL 0: Avionics_Board (?.D19/A5 J?#1.37 R?#3.2), BMP_388_Avionics_board (U?#1.2), BNO_055_Avionics_board (U?#2.19), TE_BARO_Avionics_board (U?#4.8)
SDA 0: Avionics_Board (?.D18/A4 J?#1.39 R?#4.2), BMP_388_Avionics_board (U?#1.4), BNO_055_Avionics_board (U?#2.20), TE_BARO_Avionics_board (U?#4.7)